# Altium schematic sheet MCU.SchDoc
size A4; SheetNumber: 1; SheetTotal: 3
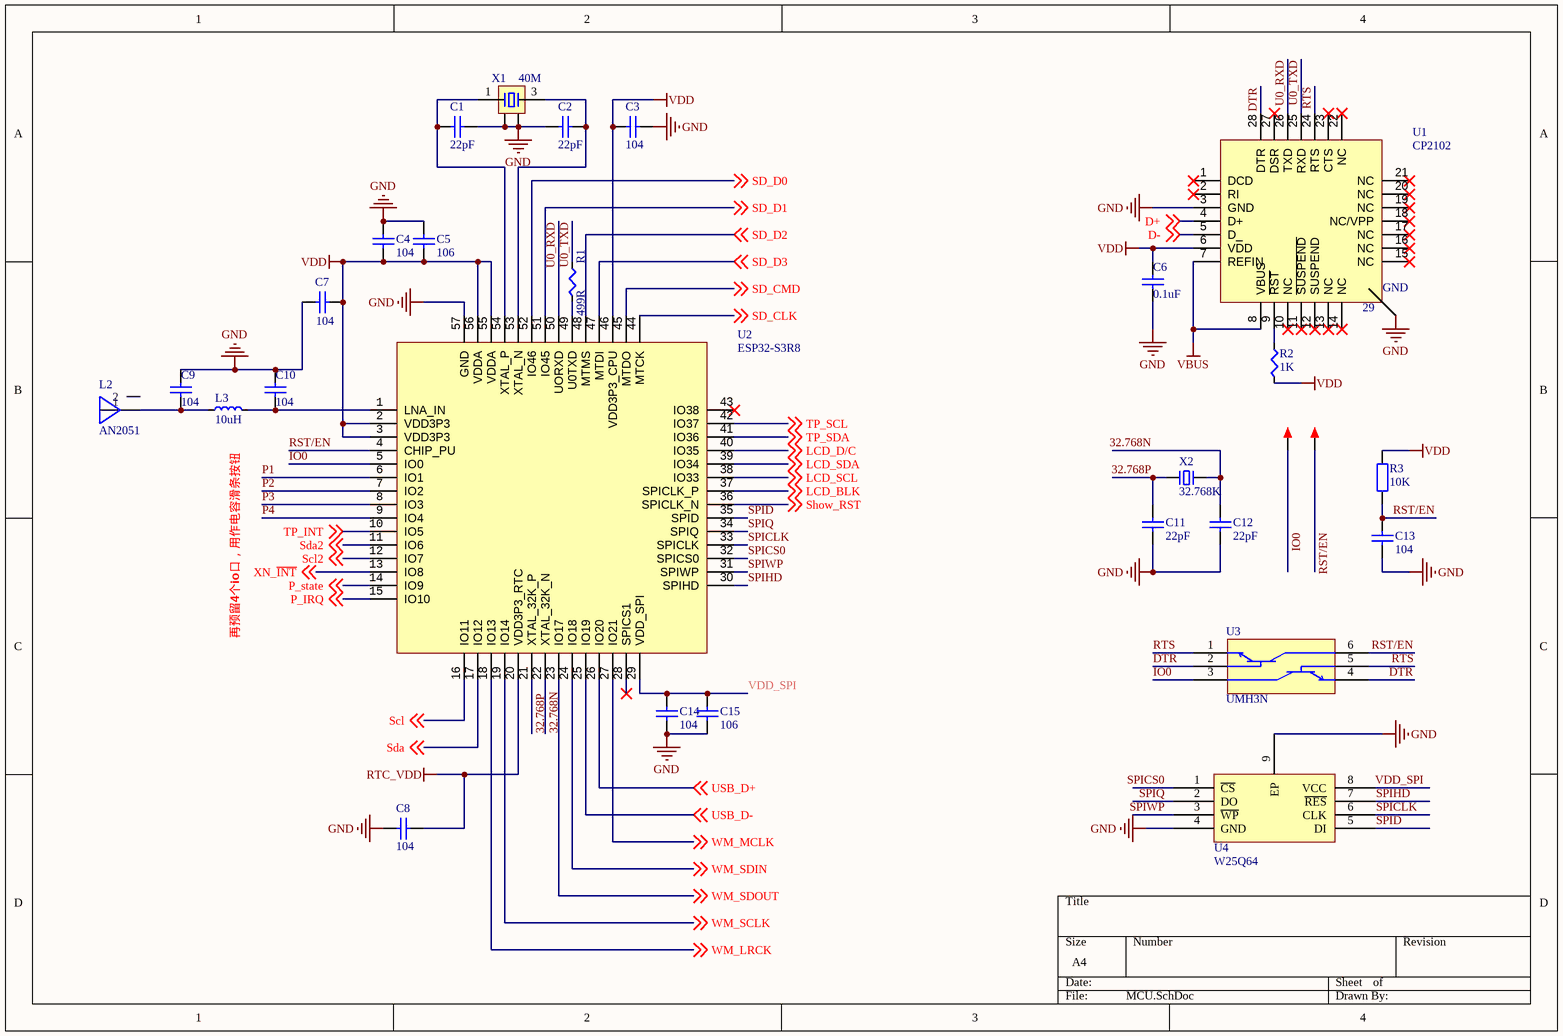
[diagram p0: MCU.SchDoc]

## Parts
C1  22pF  [C 0603_L]
C2  22pF  [C 0603_L]
C3  104  [C 0603_L]
C4  104  [C 0603_L]
C5  106  [C 0603_L]
C6  0.1uF  [C 0603_L]
C7  104  [C 0603_L]
C8  104  [C 0603_L]
C9  104  [C 0603_L]
C10  104  [C 0603_L]
C11  22pF  [C 0603_L]
C12  22pF  [C 0603_L]
C13  104  [C 0603_L]
C14  104  [C 0603_L]
C15  106  [C 0603_L]
L2  AN2051  [AN9520]
L3  10uH  [L 0603]
R1  499R  [R 0603_L]
R2  1K  [R 0603_L]
R3  10K  [R 0603_L]
TP1  TEST  [TEST 1]  (value not drawn)
TP2  TEST  [TEST 1]  (value not drawn)
U1  CP2102  [QFN28 5x5_M]
U2  ESP32-S3R8  [QFN56  7x7]
U3  UMH3N  [SOT-363]
U4  W25Q64  [WSON-8_L8.0-W6.0-P1.27-TL-EP]
X1  40M  [OSC 3225-4P]
X2  32.768K  [OSC 3215-2P]

## Nets
GND: C1.2 C2.1 C3.2 C4.2 C5.2 C6.1 C7.1 C8.2 C9.2 C10.2 C11.1 C12.1 C13.1 C14.1 C15.1 U1.3(GND) U1.29(GND) U2.57(GND) U4.4(GND) U4.9(EP) X1.2 X1.4
RTC_VDD: C8.1 U2.20(VDD3P3_RTC)
VBUS: U1.7(REFIN) U1.8(VBUS)
VDD: C3.1 C4.1 C5.1 C6.2 C7.2 R2.1 R3.2 U1.6(VDD) U2.2(VDD3P3) U2.3(VDD3P3) U2.46(VDD3P3_CPU) U2.55(VDDA) U2.56(VDDA)
32.768N: C12.2 U2.22(XTAL_32K_N) X2.1
32.768P: C11.2 U2.21(XTAL_32K_P) X2.2
D+: U1.4(D+) ; off-sheet D+
D-: U1.5(D_) ; off-sheet D-
DTR: U1.28(DTR) U3.2(B2) U3.4(E2)
IO0: TP1.1 U2.5(IO0) U3.3(C2)
LCD_BLK: U2.37(SPICLK_P) ; off-sheet LCD_BLK
LCD_D/C: U2.40(IO35) ; off-sheet LCD_D/C
LCD_SCL: U2.38(IO33) ; off-sheet LCD_SCL
LCD_SDA: U2.39(IO34) ; off-sheet LCD_SDA
P1: U2.6(IO1)
P2: U2.7(IO2)
P3: U2.8(IO3)
P4: U2.9(IO4)
P_IRQ: U2.15(IO10) ; off-sheet P_IRQ
P_state: U2.14(IO9) ; off-sheet P_state
RST/EN: C13.2 R3.1 TP2.1 U2.4(CHIP_PU) U3.6(C1)
RTS: U1.24(RTS) U3.1(E1) U3.5(B2)
Scl: U2.16(IO11) ; off-sheet Scl
Scl2: U2.12(IO7) ; off-sheet Scl2
SD_CLK: U2.44(MTCK) ; off-sheet SD_CLK
SD_CMD: U2.45(MTDO) ; off-sheet SD_CMD
SD_D0: U2.52(IO46) ; off-sheet SD_D0
SD_D1: U2.51(IO45) ; off-sheet SD_D1
SD_D2: U2.48(MTMS) ; off-sheet SD_D2
SD_D3: U2.47(MTDI) ; off-sheet SD_D3
Sda: U2.17(IO12) ; off-sheet Sda
Sda2: U2.11(IO6) ; off-sheet Sda2
Show_RST: U2.36(SPICLK_N) ; off-sheet Show_RST
SPICLK: U2.33(SPICLK) U4.6(CLK)
SPICS0: U2.32(SPICS0) U4.1(~{CS})
SPID: U2.35(SPID) U4.5(DI)
SPIHD: U2.30(SPIHD) U4.7(~{RES})
SPIQ: U2.34(SPIQ) U4.2(DO)
SPIWP: U2.31(SPIWP) U4.3(~{WP})
TP_INT: U2.10(IO5) ; off-sheet TP_INT
TP_SCL: U2.42(IO37) ; off-sheet TP_SCL
TP_SDA: U2.41(IO36) ; off-sheet TP_SDA
U0_RXD: U1.26(TXD) U2.50(UORXD)
U0_TXD: R1.2 U1.25(RXD)
USB_D+: U2.26(IO20) ; off-sheet USB_D+
USB_D-: U2.25(IO19) ; off-sheet USB_D-
VDD_SPI: C14.2 C15.2 U2.29(VDD_SPI) U4.8(VCC)
WM_LRCK: U2.18(IO13) ; off-sheet WM_LRCK
WM_MCLK: U2.27(IO21) ; off-sheet WM_MCLK
WM_SCLK: U2.19(IO14) ; off-sheet WM_SCLK
WM_SDIN: U2.24(IO18) ; off-sheet WM_SDIN
WM_SDOUT: U2.23(IO17) ; off-sheet WM_SDOUT
XN_~{INT}: U2.13(IO8) ; off-sheet XN_~{INT}
NetC1_1: C1.1 U2.54(XTAL_P) X1.1
NetC2_2: C2.2 U2.53(XTAL_N) X1.3
NetC9_1: C9.1 L2.1 L3.1
NetC10_1: C10.1 L3.2 U2.1(LNA_IN)
NetR1_1: R1.1 U2.49(U0TXD)
NetR2_2: R2.2 U1.9(~{RST})

Not connected (* = marked no-connect by the designer): L2 2; U1 1(DCD)* 2(RI)* 10(NC)* 11(~{SUSPEND})* 12(SUSPEND)* 13(NC)* 14(NC)* 15(NC)* 16(NC)* 17(NC)* 18(NC/VPP)* 19(NC)* 20(NC)* 21(NC)* 22(NC)* 23(CTS)* 27(DSR)*; U2 28(SPICS1)* 43(IO38)*

## Notes on the sheet
- 再预留4个io口，用作电容滑条按钮

## Library data of the parts
C1-C15 = C: 贴片电容; BOM名称: 无极性贴片电容; 联系卖家，免费查找封装: 唯一出售店铺网址https://shop463601444.taobao.com; 封装库来自淘宝卖家ID：黄晶宝石: 其他店铺购入均为盗版假冒封装库
L2 = AN2051: AN2051-245 2.4G蓝牙wifi 贴片 2051
L3 = L: 小功率贴片电感; 联系卖家，免费查找封装: 唯一出售店铺网址https://shop463601444.taobao.com; 封装库来自淘宝卖家ID：黄晶宝石: 其他店铺购入均为盗版假冒封装库; BOM名称: 小功率贴片电感
R1-R3 = R: 贴片电阻; 联系卖家，免费查找封装: 唯一出售店铺网址https://shop463601444.taobao.com; 封装库来自淘宝卖家ID：黄晶宝石: 其他店铺购入均为盗版假冒封装库; BOM名称: 贴片电阻
TP1 TP2 = TEST: 测试点; 联系卖家，免费查找封装: 唯一出售店铺网址https://shop463601444.taobao.com; BOM名称: 测试点
U1 = CP2102: USB转TTL
U2 = ESP32S3: ESP32S3  7x7
U3 = UMH3N: 2NPN预偏式(双)
U4 = W25Q64——wson: C77819
X1 = XTAL-4P: 4脚无源晶振; 联系卖家，免费查找封装: 唯一出售店铺网址https://shop463601444.taobao.com; BOM名称: 4脚无源晶振
X2 = XTAL-2P: 2脚无源脚晶振; 联系卖家，免费查找封装: 唯一出售店铺网址https://shop463601444.taobao.com; BOM名称: 2脚无源脚晶振